# Altium project roverSwitch.PrjPcb (part 2 of 2)

## Sheet CAN-SW.SchDoc
size A4; DrawnBy: Emile Renaud; Revision: V1.0; SheetNumber: 4; SheetTotal: 8
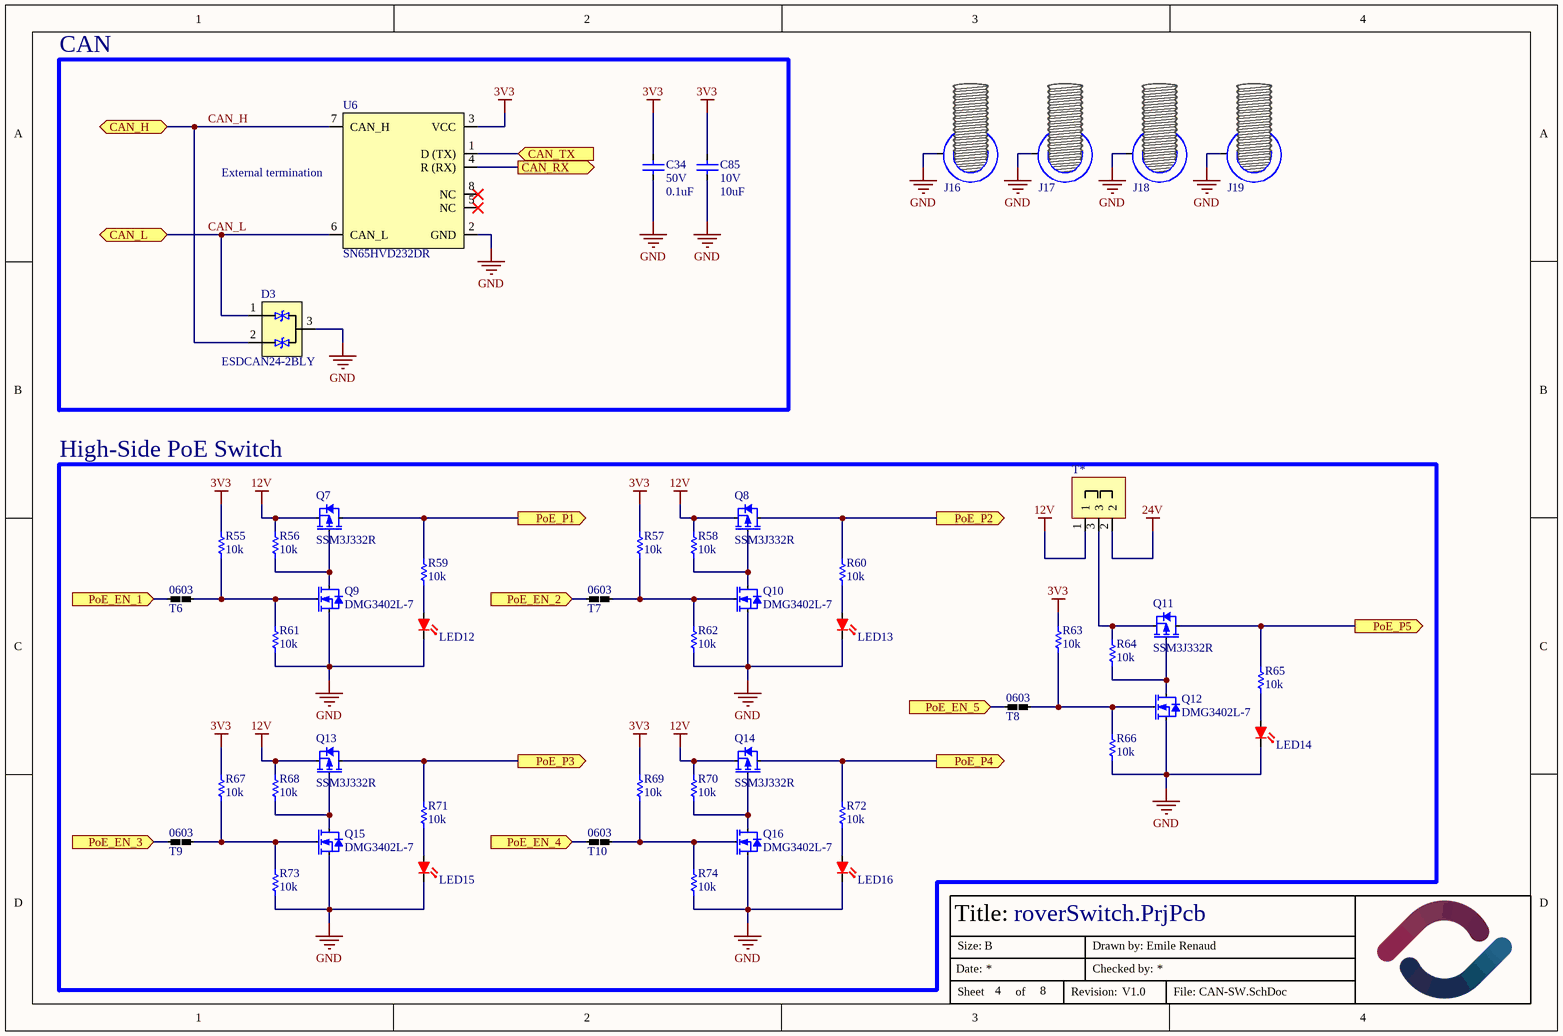
[diagram p7: CAN-SW.SchDoc]

### Parts
C34  value 0.1uF  Volt: 50V  [CAPACITOR-0603]  (hidden comment: Capacitor-0603-0.1uF-50V-X7R)
C85  value 10uF  Volt: 10V  [CAPACITOR-0603]  (hidden comment: Capacitor-0603-10uF-10V-X5R)
D3  ESDCAN24-2BLY  [SOT-23-3]
J16  hole  [HOLE-3.40MM-M3-8MMEYELET]  (value not drawn)  (no BOM)
J17  hole  [HOLE-3.40MM-M3-8MMEYELET]  (value not drawn)  (no BOM)
J18  hole  [HOLE-3.40MM-M3-8MMEYELET]  (value not drawn)  (no BOM)
J19  hole  [HOLE-3.40MM-M3-8MMEYELET]  (value not drawn)  (no BOM)
LED12  B1911USD-20D000114U1930  [LED-0603-2PIN]  (value not drawn)
LED13  B1911USD-20D000114U1930  [LED-0603-2PIN]  (value not drawn)
LED14  B1911USD-20D000114U1930  [LED-0603-2PIN]  (value not drawn)
LED15  B1911USD-20D000114U1930  [LED-0603-2PIN]  (value not drawn)
LED16  B1911USD-20D000114U1930  [LED-0603-2PIN]  (value not drawn)
Q7  SSM3J332R  [SOT-23-3]
Q8  SSM3J332R  [SOT-23-3]
Q9  DMG3402L-7  [SOT-23-3]
Q10  DMG3402L-7  [SOT-23-3]
Q11  SSM3J332R  [SOT-23-3]
Q12  DMG3402L-7  [SOT-23-3]
Q13  SSM3J332R  [SOT-23-3]
Q14  SSM3J332R  [SOT-23-3]
Q15  DMG3402L-7  [SOT-23-3]
Q16  DMG3402L-7  [SOT-23-3]
R55  value 10k  [Resistor-0603]  (hidden comment: SMT resistor)
R56  value 10k  [Resistor-0603]  (hidden comment: SMT resistor)
R57  value 10k  [Resistor-0603]  (hidden comment: SMT resistor)
R58  value 10k  [Resistor-0603]  (hidden comment: SMT resistor)
R59  value 10k  [Resistor-0603]  (hidden comment: SMT resistor)
R60  value 10k  [Resistor-0603]  (hidden comment: SMT resistor)
R61  value 10k  [Resistor-0603]  (hidden comment: SMT resistor)
R62  value 10k  [Resistor-0603]  (hidden comment: SMT resistor)
R63  value 10k  [Resistor-0603]  (hidden comment: SMT resistor)
R64  value 10k  [Resistor-0603]  (hidden comment: SMT resistor)
R65  value 10k  [Resistor-0603]  (hidden comment: SMT resistor)
R66  value 10k  [Resistor-0603]  (hidden comment: SMT resistor)
R67  value 10k  [Resistor-0603]  (hidden comment: SMT resistor)
R68  value 10k  [Resistor-0603]  (hidden comment: SMT resistor)
R69  value 10k  [Resistor-0603]  (hidden comment: SMT resistor)
R70  value 10k  [Resistor-0603]  (hidden comment: SMT resistor)
R71  value 10k  [Resistor-0603]  (hidden comment: SMT resistor)
R72  value 10k  [Resistor-0603]  (hidden comment: SMT resistor)
R73  value 10k  [Resistor-0603]  (hidden comment: SMT resistor)
R74  value 10k  [Resistor-0603]  (hidden comment: SMT resistor)
T6  NetTie_0603_Short  [NetTie-0603-short]  (value not drawn)
T7  NetTie_0603_Short  [NetTie-0603-short]  (value not drawn)
T8  NetTie_0603_Short  [NetTie-0603-short]  (value not drawn)
T9  NetTie_0603_Short  [NetTie-0603-short]  (value not drawn)
T10  NetTie_0603_Short  [NetTie-0603-short]  (value not drawn)
T*  Jumper-3pos-small  [Jumper-3pos-small]  (value not drawn)
U6  SN65HVD232DR  [SOIC-8]

### Blocks framed on the sheet
CAN: C34 C85 D3 U6
High-Side PoE Switch: LED12-LED16 Q7-Q16 R55-R74 T6-T10 T*

### Ports
CAN_H (bidir), CAN_L (bidir), CAN_RX (out), CAN_TX (in), PoE_EN_1 (in), PoE_EN_2 (in), PoE_EN_3 (in), PoE_EN_4 (in), PoE_EN_5 (in), PoE_P1 (out), PoE_P2 (out), PoE_P3 (out), PoE_P4 (out), PoE_P5 (out)

### Nets
3V3: C34.2 C85.2 R55.2 R57.2 R63.2 R67.2 R69.2 U6.3(VCC)
12V: Q7.2(S) Q8.2(S) Q13.2(S) Q14.2(S) R56.2 R58.2 R68.2 R70.2 T*.1
24V: T*.2
GND: C34.1 C85.1 D3.3(L3) J16.1 J17.1 J18.1 J19.1 LED12.1(K) LED13.1(K) LED14.1(K) LED15.1(K) LED16.1(K) Q9.2(S) Q10.2(S) Q12.2(S) Q15.2(S) Q16.2(S) R61.1 R62.1 R66.1 R73.1 R74.1 U6.2(GND)
CAN_H: D3.2(GND) U6.7(CAN_H) ; port CAN_H
CAN_L: D3.1(L2) U6.6(CAN_L) ; port CAN_L
CAN_RX: U6.4(R_(RX)) ; port CAN_RX
CAN_TX: U6.1(D_(TX)) ; port CAN_TX
PoE_EN_1: T6.2 ; port PoE_EN_1
PoE_EN_2: T7.2 ; port PoE_EN_2
PoE_EN_3: T9.2 ; port PoE_EN_3
PoE_EN_4: T10.2 ; port PoE_EN_4
PoE_EN_5: T8.2 ; port PoE_EN_5
PoE_P1: Q7.3(D) R59.2 ; port PoE_P1
PoE_P2: Q8.3(D) R60.2 ; port PoE_P2
PoE_P3: Q13.3(D) R71.2 ; port PoE_P3
PoE_P4: Q14.3(D) R72.2 ; port PoE_P4
PoE_P5: Q11.3(D) R65.2 ; port PoE_P5
NetLED12_2: LED12.2(R) R59.1
NetLED13_2: LED13.2(R) R60.1
NetLED14_2: LED14.2(R) R65.1
NetLED15_2: LED15.2(R) R71.1
NetLED16_2: LED16.2(R) R72.1
NetQ7_1: Q7.1(G) Q9.3(D) R56.1
NetQ8_1: Q8.1(G) Q10.3(D) R58.1
NetQ9_1: Q9.1(G) R55.1 R61.2 T6.1
NetQ10_1: Q10.1(G) R57.1 R62.2 T7.1
NetQ11_1: Q11.1(G) Q12.3(D) R64.1
NetQ11_2: Q11.2(S) R64.2 T*.3
NetQ12_1: Q12.1(G) R63.1 R66.2 T8.1
NetQ13_1: Q13.1(G) Q15.3(D) R68.1
NetQ14_1: Q14.1(G) Q16.3(D) R70.1
NetQ15_1: Q15.1(G) R67.1 R73.2 T9.1
NetQ16_1: Q16.1(G) R69.1 R74.2 T10.1

Not connected (* = marked no-connect by the designer): U6 5(NC)* 8(NC)*

### Notes on the sheet
- (near U6) External termination
- Title:
- Date:
- Size:
- B
- Drawn by:
- Checked by:
- Sheet
- of
- Revision:
- File:
- (in symbol NetTie_0603_Short) 0603

### Library data of the parts
C34 = Capacitor-0603-0.1uF-50V-X7R: Precision: X7R-10%; Package / Case: Metric 1608, EIA 0603; Mounted: Yes; Supplier 1: Digi-Key; Supplier Part Number 1: 1276-1935-2-ND; Supplier 2: Digi-Key; Supplier Part Number 2: 1276-1934-2-ND
C85 = Capacitor-0603-10uF-10V-X5R: 10 µF ±20% 10V Ceramic Capacitor X5R 0603 (1608 Metric); Supplier 1: Digikey; Supplier Part Number 1: 4713-GMC10X5R106M10NTCT-ND; Mounted: Yes; Package / Case: Metric 1608 , EIA 0603; Precision: 20%
D3 = ESDCAN24-2BLY: 55V Clamp 6A (8/20µs) Ipp Tvs Diode Surface Mount SOT-23; Volt: 24; Supplier 1: Digi-Key; Supplier Part Number 1: 5272-ESDCAN24-2BLYCT-ND; Mounted: Yes; Package / Case: SOT-23-3
J16-J19 = Hole 3.40mm M3-Eyelet: Hole for M3 Bolt with 8mm pad; Mounted: N/A
LED12-LED16 = B1911USD-20D000114U1930: LED RED CLEAR 0603 SMD; Package / Case: 0603 (1608 Metric); Mounted: Yes; Supplier 1: Digi-Key; Supplier Part Number 1: 3147-B1911USD-20D000114U1930CT-ND
Q7 Q8 Q11 Q13 Q14 = SSM3J332R: P-Channel 30 V 6A (Ta) 1W (Ta) Surface Mount SOT-23F; Volt: 30V; Supplier 1: Digi-Key; Supplier Part Number 1: SSM3J332RLFCT-ND; Package / Case: SOT-523; Mounted: Yes; Current: 6A
Q9 Q10 Q12 Q15 Q16 = DMG3402L-7: N-Channel 30 V 4A (Ta) 1.4W (Ta) Surface Mount SOT-23-3; Volt: 30V; Supplier 1: Digi-Key; Supplier Part Number 1: DMG3402L-7DICT-ND; Package / Case: SOT-23-3; Mounted: Yes; Current: 4A
R55-R74 = Resistor-0603-10k: Resistor0603-10k; Precision: 1%; Watt: 0.1W; Mounted: Yes; Package / Case: Metric 1608, EIA 0603; Supplier 1: Digi-Key; Supplier Part Number 1: 311-10.0KHRTR-ND
U6 = SN65HVD232DR: 1/1 Transceiver Half CANbus 8-SOIC; Package / Case: 8-SOIC; Mounted: Yes; Supplier 1: Digikey; Supplier Part Number 1: 296-26344-1-ND; HelpURL: https://www.ti.com/lit/ds/symlink/sn65hvd230.pdf?HQS=dis-dk-null-digikeymode-dsf-pf-null-wwe&ts=1723930967656&ref_url=https%253A%252F%252Fwww.ti.com%252Fgeneral%252Fdocs%252Fsuppproductinfo.tsp%253FdistId%253D10%2526gotoUrl%253Dhttps%253A%252F%252Fwww.ti.com%252Flit%252Fgpn%252Fsn65hvd230

## Nets that join several sheets
1V2: KSZ_Switch_Control (21 pins), Power (C77.2 J21.1 U4.2 U4.4)
2V5: KSZ_Switch_Control (L2.1 L3.1), Power (C75.1 J20.1 U3.5)
3V3: Connectors_2 (R5.1 R8.1), KSZ_Switch_Control (12 pins), Connectors_1 (8 pins), ESP32 (18 pins), Power (9 pins), CAN-SW (8 pins)
5V_USB: Connectors_2 (P3.7 P4.2), ESP32 (D4.5 P7.1), Power (P10.3)
12V: Power (7 pins), CAN-SW (9 pins)
24V: Power (9 pins), CAN-SW (T*.2)
GND: Connectors_2 (16 pins), KSZ_Switch (13 pins), KSZ_Switch_Control (55 pins), Connectors_1 (18 pins), ESP32 (30 pins), Power (27 pins), CAN-SW (23 pins)
CAN_H: Connectors_2 (P3.1 P4.4), CAN-SW (D3.2 U6.7)
CAN_L: Connectors_2 (P3.2 P4.3), CAN-SW (D3.1 U6.6)
CAN_RX: ESP32 (U7.19), CAN-SW (U6.4)
CAN_TX: ESP32 (U7.18), CAN-SW (U6.1)
P1_G_LED: KSZ_Switch (R14.2 U2.106), Connectors_1 (LED2.1)
P1_Y_LED: KSZ_Switch (R13.2 U2.105), Connectors_1 (LED3.1)
P2_G_LED: KSZ_Switch (R16.2 U2.92), Connectors_1 (LED4.1)
P2_Y_LED: KSZ_Switch (R15.2 U2.91), Connectors_1 (LED7.1)
P3_G_LED: KSZ_Switch (R17.2 U2.89), Connectors_1 (LED8.1)
P3_Y_LED: KSZ_Switch (U2.88), Connectors_1 (LED9.1)
P4_G_LED: KSZ_Switch (R20.2 U2.86), Connectors_1 (LED10.1)
P4_Y_LED: KSZ_Switch (R19.2 U2.85), Connectors_1 (LED11.1)
P5_G_LED: Connectors_2 (P2.9), KSZ_Switch (R21.2 U2.103)
P5_Y_LED: Connectors_2 (P2.11), KSZ_Switch (U2.102)
PHY_RX_1_N: KSZ_Switch (U2.5), Connectors_1 (Q5.8)
PHY_RX_1_P: KSZ_Switch (U2.4), Connectors_1 (Q5.6)
PHY_RX_2_N: KSZ_Switch (U2.16), Connectors_1 (Q6.8)
PHY_RX_2_P: KSZ_Switch (U2.15), Connectors_1 (Q6.6)
PHY_RX_3_N: KSZ_Switch (U2.27), Connectors_1 (Q17.8)
PHY_RX_3_P: KSZ_Switch (U2.26), Connectors_1 (Q17.6)
PHY_RX_4_N: KSZ_Switch (U2.38), Connectors_1 (Q18.8)
PHY_RX_4_P: KSZ_Switch (U2.37), Connectors_1 (Q18.6)
PHY_RX_5_N: Connectors_2 (Q4.8), KSZ_Switch (U2.116)
PHY_RX_5_P: Connectors_2 (Q4.6), KSZ_Switch (U2.115)
PHY_TX_1_N: KSZ_Switch (U2.2), Connectors_1 (Q5.3)
PHY_TX_1_P: KSZ_Switch (U2.1), Connectors_1 (Q5.1)
PHY_TX_2_N: KSZ_Switch (U2.13), Connectors_1 (Q6.3)
PHY_TX_2_P: KSZ_Switch (U2.12), Connectors_1 (Q6.1)
PHY_TX_3_N: KSZ_Switch (U2.25), Connectors_1 (Q17.3)
PHY_TX_3_P: KSZ_Switch (U2.24), Connectors_1 (Q17.1)
PHY_TX_4_N: KSZ_Switch (U2.35), Connectors_1 (Q18.3)
PHY_TX_4_P: KSZ_Switch (U2.34), Connectors_1 (Q18.1)
PHY_TX_5_N: Connectors_2 (Q4.3), KSZ_Switch (U2.113)
PHY_TX_5_P: Connectors_2 (Q4.1), KSZ_Switch (U2.112)
PoE_EN_1: ESP32 (U7.11), CAN-SW (T6.2)
PoE_EN_2: ESP32 (U7.12), CAN-SW (T7.2)
PoE_EN_3: ESP32 (U7.13), CAN-SW (T9.2)
PoE_EN_4: ESP32 (U7.14), CAN-SW (T10.2)
PoE_EN_5: ESP32 (U7.15), CAN-SW (T8.2)
PoE_P1: Connectors_1 (P5.A4 P5.A5), CAN-SW (Q7.3 R59.2)
PoE_P2: Connectors_1 (P5.B4 P5.B5), CAN-SW (Q8.3 R60.2)
PoE_P3: Connectors_1 (P5.C4 P5.C5), CAN-SW (Q13.3 R71.2)
PoE_P4: Connectors_1 (P5.D4 P5.D5), CAN-SW (Q14.3 R72.2)
PoE_P5: Connectors_2 (P2.4 P2.5), CAN-SW (Q11.3 R65.2)
RESET_N: Connectors_2 (P1.3 P11.3), KSZ_Switch_Control (5 pins)
RX1: Connectors_2 (P1.2 P11.1), ESP32 (U7.39)
S_RX_7_N: Connectors_2 (P1.5 P11.11), KSZ_Switch (U2.78)
S_RX_7_P: Connectors_2 (P1.7 P11.9), KSZ_Switch (U2.79)
S_TX_7_N: Connectors_2 (P1.11 P11.5), KSZ_Switch (U2.82)
S_TX_7_P: Connectors_2 (P1.9 P11.7), KSZ_Switch (U2.81)
SPI_CLK: KSZ_Switch (U2.101), ESP32 (U7.43)
SPI_CS: KSZ_Switch (U2.100), ESP32 (U7.42)
SPI_MISO: KSZ_Switch (U2.97), ESP32 (U7.40)
SPI_MOSI: KSZ_Switch (U2.98), ESP32 (U7.41)
TX1: Connectors_2 (P1.1 P11.2), ESP32 (U7.38)